# EAGLE design os21_smt (EAGLE 6.5.0)
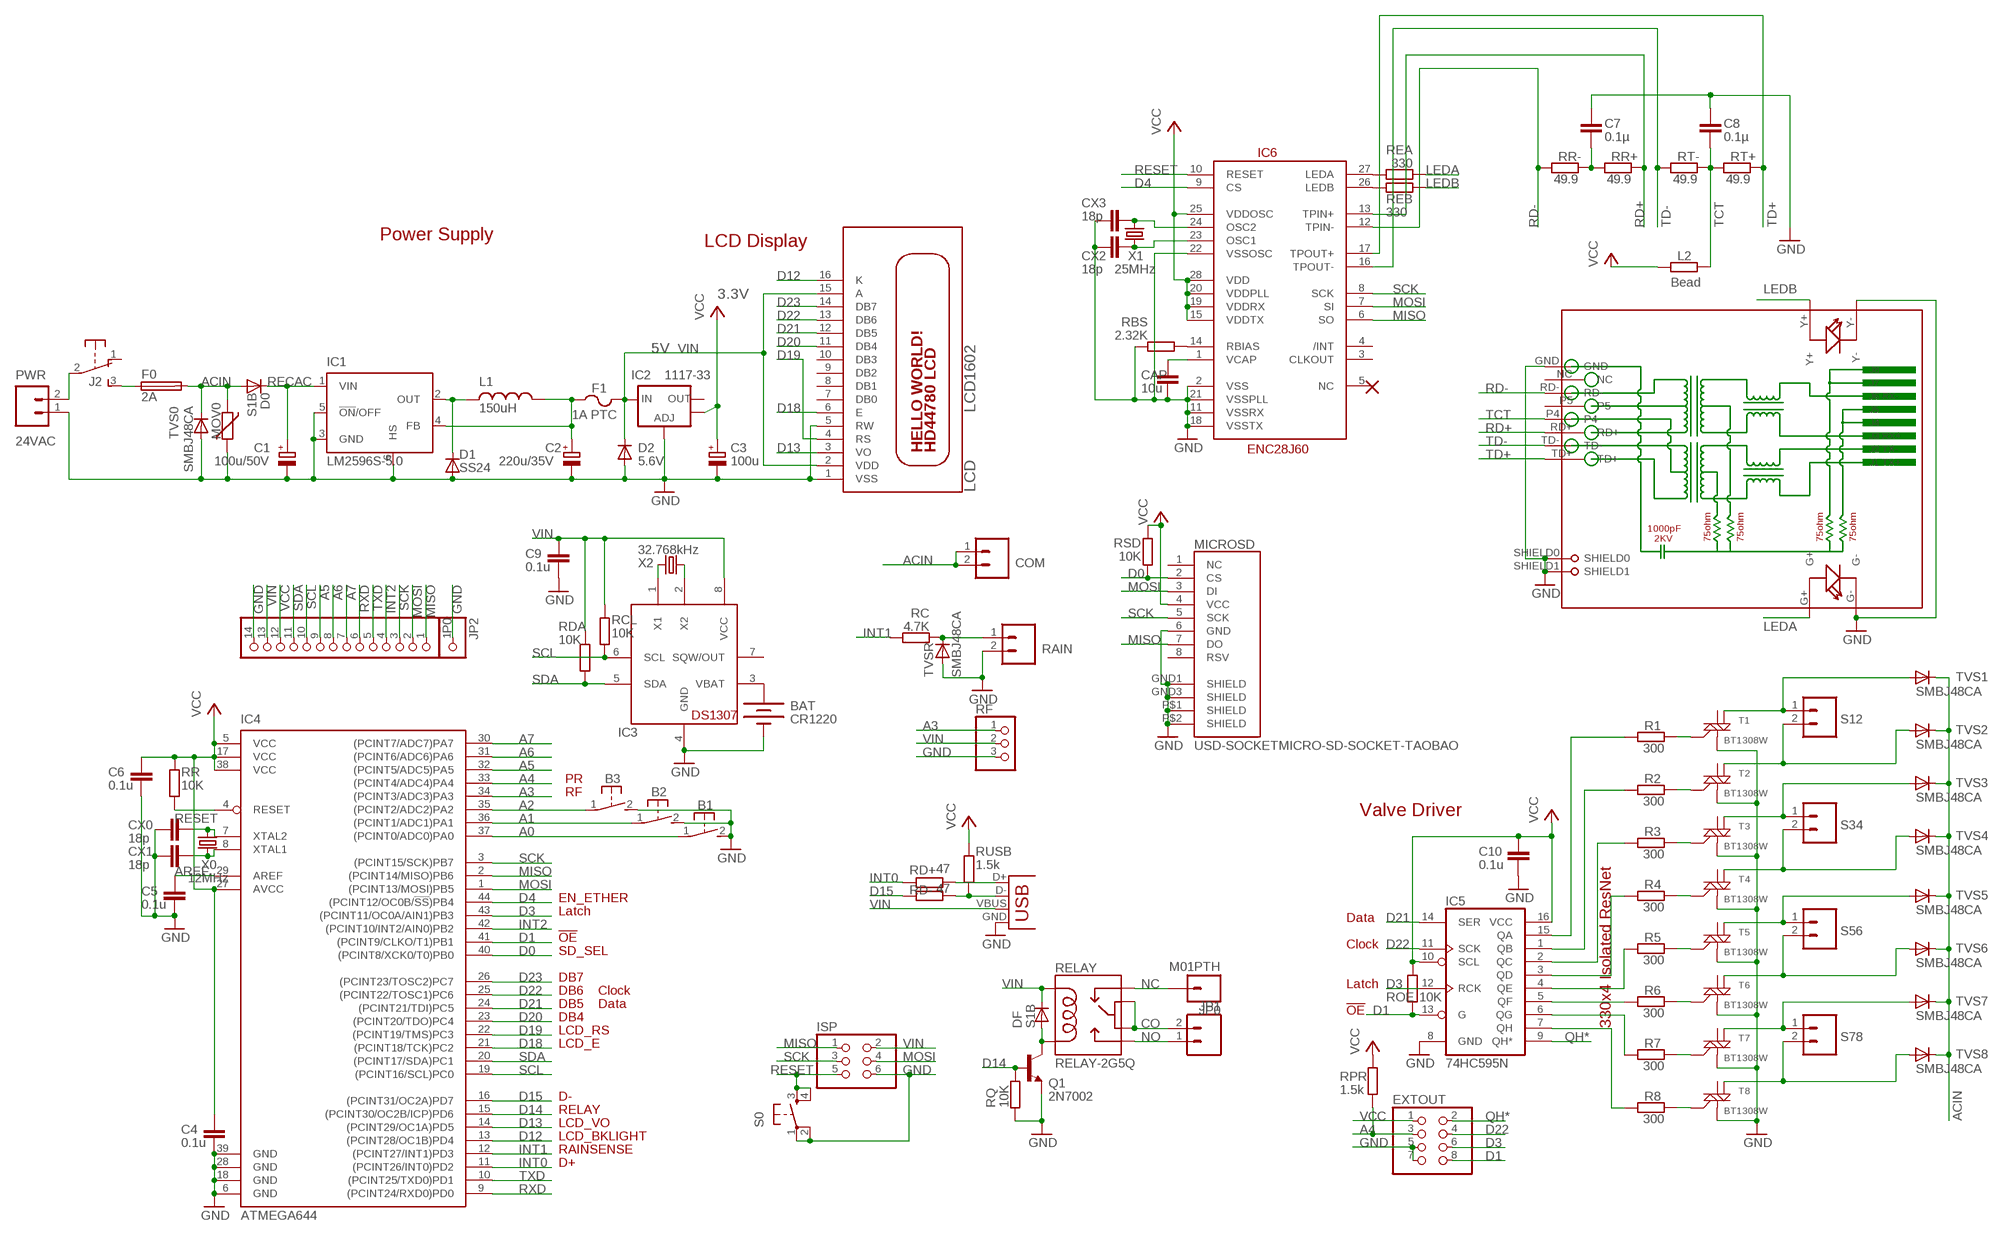
[diagram p0: schematic, sheet 1]

## Parts
B1  31-XX  [B3F-31XX]
B2  31-XX  [B3F-31XX]
B3  31-XX  [B3F-31XX]
BAT  CR1220  BATTERYBATTERY_12MM_SMT  [BATTCON_12MM_SMT]
C1  100u/50V  CPOL-EUE3.5-8  [E3,5-8]
C2  220u/35V  CPOL-EUE3.5-8  [E3,5-8]
C3  100u  CPOL-EUD  [PANASONIC_D]
C4  0.1u  C-EUC0805  [C0805]
C5  0.1u  C-EUC0805  [C0805]
C6  0.1u  C-EUC0805  [C0805]
C7  0.1µ  C-EUC0805  [C0805]
C8  0.1µ  C-EUC0805  [C0805]
C9  0.1u  C-EUC0805  [C0805]
C10  0.1u  C-EUC0805  [C0805]
CAP  10u  C-EUC0805  [C0805]
COM  M025MM-X  [SCREWTERMINAL-5MM-2-X]
CX0  18p  C-EUC0805  [C0805]
CX1  18p  C-EUC0805  [C0805]
CX2  18p  C-EUC0805  [C0805]
CX3  18p  C-EUC0805  [C0805]
D0  S1B  DIODE-DO-214AC  [DO-214AC]
D1  SS24  DIODE-SMB  [SMB]
D2  5.6V  DIODE-MINIMELF  [MINIMELF]
DF  S1B  DIODE-DO-214AC  [DO-214AC]
EXTOUT  PINHD-2X4  [2X04]
F0  2A  FUSESHK20L  [SHK20L]
F1  1A PTC  PTCFUSE-1812  [1812]
IC1  LM2596S-5.0  LM2596S  [TO263-5]
IC2  1117-33  V_REG_LM1117SOT223  [SOT223]
IC3  DS1307  DS1307SOIC  [SO08]
IC4  ATMEGA644  ATMEGA644A  [TQFP44]
IC5  74HC595N  74LS595D  [SO16]
IC6  ENC28J60  ENC28J60SO28LONG  [SOIC28WLONG]
ISP  PINHD-2X3  [2X03]
J2  EG1206  [EG1206]
JP0  M01PTH  [1X01]
JP1  M025MM-X  [SCREWTERMINAL-5MM-2-X]
JP2  PINHD-1X1CB  [1X01-CLEANBIG]
L1  150uH  INDUCTORPWR  [CDRH125]
L2  Bead  R-EU_R0805  [R0805]
LCD  LCD1602  HD44780LCDNOHOLE  [LCD1602A]
MICROSD  USD-SOCKETMICRO-SD-SOCKET-TAOBAO  [MICRO-SD-SOCKET-TAOBAO]
MOV0  MOV  VARISTOR-5  [R-5]
P0  PINHD-1X14-CB  [1X14-CB]
PWR  24VAC  M024MM-X  [SCREWTERMINAL-4MM-2-X]
Q1  2N7002  TRANSISTOR_NPNSOT23-3  [SOT23-3]
R1  300  R-EU_R0805  [R0805]
R2  300  R-EU_R0805  [R0805]
R3  300  R-EU_R0805  [R0805]
R4  300  R-EU_R0805  [R0805]
R5  300  R-EU_R0805  [R0805]
R6  300  R-EU_R0805  [R0805]
R7  300  R-EU_R0805  [R0805]
R8  300  R-EU_R0805  [R0805]
RAIN  M025MM-X  [SCREWTERMINAL-5MM-2-X]
RBS  2.32K  R-EU_R0805  [R0805]
RC  4.7K  R-EU_R0805  [R0805]
RCL  10K  R-EU_R0805  [R0805]
RD+  47  R-EU_R0805  [R0805]
RD-  47  R-EU_R0805  [R0805]
RDA  10K  R-EU_R0805  [R0805]
REA  330  R-EU_R0805  [R0805]
REB  330  R-EU_R0805  [R0805]
RELAY  RELAY-2G5Q  [RELAY-G5V]
RF  PINHD-1X3  [1X03]
RJ45  HR911105A  [HR911105A]
ROE  10K  R-EU_R0805  [R0805]
RPR  1.5k  R-EU_R0805  [R0805]
RQ  10K  R-EU_R0805  [R0805]
RR  10K  R-EU_R0805  [R0805]
RR+  49.9  R-EU_R0805  [R0805]
RR-  49.9  R-EU_R0805  [R0805]
RSD  10K  R-EU_R0805  [R0805]
RT+  49.9  R-EU_R0805  [R0805]
RT-  49.9  R-EU_R0805  [R0805]
RUSB  1.5k  R-EU_R0805  [R0805]
S0  TAC_SWITCHSMD  [TACTILE_SWITCH_SMD]
S12  M025MM-X  [SCREWTERMINAL-5MM-2-X]
S34  M025MM-X  [SCREWTERMINAL-5MM-2-X]
S56  M025MM-X  [SCREWTERMINAL-5MM-2-X]
S78  M025MM-X  [SCREWTERMINAL-5MM-2-X]
T1  BT1308W  MAC97SOT223  [SOT223]
T2  BT1308W  MAC97SOT223  [SOT223]
T3  BT1308W  MAC97SOT223  [SOT223]
T4  BT1308W  MAC97SOT223  [SOT223]
T5  BT1308W  MAC97SOT223  [SOT223]
T6  BT1308W  MAC97SOT223  [SOT223]
T7  BT1308W  MAC97SOT223  [SOT223]
T8  BT1308W  MAC97SOT223  [SOT223]
TVS0  SMBJ48CA  DIODE-SMB  [SMB]
TVS1  SMBJ48CA  DIODE-SMB  [SMB]
TVS2  SMBJ48CA  DIODE-SMB  [SMB]
TVS3  SMBJ48CA  DIODE-SMB  [SMB]
TVS4  SMBJ48CA  DIODE-SMB  [SMB]
TVS5  SMBJ48CA  DIODE-SMB  [SMB]
TVS6  SMBJ48CA  DIODE-SMB  [SMB]
TVS7  SMBJ48CA  DIODE-SMB  [SMB]
TVS8  SMBJ48CA  DIODE-SMB  [SMB]
TVSR  SMBJ48CA  DIODE-SMB  [SMB]
USB  USBPTH  [USB-B-PTH]
X0  12MHz  CRYSTALHC49UV  [HC49U-V]
X1  25MHz  CRYSTALHC49UV  [HC49U-V]
X2  32.768kHz  CRYSTALTC38H  [TC38H]

## Nets
A0: B1.1(P) IC4.37((PCINT0/ADC0)PA0)
A1: B2.1(P) IC4.36((PCINT1/ADC1)PA1)
A2: B3.1(P) IC4.35((PCINT2/ADC2)PA2)
A3: IC4.34((PCINT3/ADC3)PA3) RF.1
A4: EXTOUT.3 IC4.33((PCINT4/ADC4)PA4) RPR.1
A5: IC4.32((PCINT5/ADC5)PA5) P0.9
A6: IC4.31((PCINT6/ADC6)PA6) P0.8
A7: IC4.30((PCINT7/ADC7)PA7) P0.7
ACIN [power]: COM.1 COM.2 D0.A F0.2A MOV0.1 TVS0.C TVS1.C TVS2.C TVS3.C TVS4.C TVS5.C TVS6.C TVS7.C TVS8.C
AREF: C5.1 IC4.29(AREF)
CO [power]: JP1.2 RELAY.5 RELAY.6
D0: IC4.40((PCINT8/XCK0/T0)PB0) MICROSD.2(CS) RSD.1
D1: EXTOUT.8 IC4.41((PCINT9/CLKO/T1)PB1) IC5.13(G) ROE.1
D3: EXTOUT.6 IC4.43((PCINT11/OC0A/AIN1)PB3) IC5.12(RCK)
D4: IC4.44((PCINT12/OC0B/!SS!)PB4) IC6.9(CS)
D12: IC4.13((PCINT28/OC1B)PD4) LCD.16(K)
D13: IC4.14((PCINT29/OC1A)PD5) LCD.3(VO)
D14: IC4.15((PCINT30/OC2B/ICP)PD6) Q1.1(B) RQ.1
D15: IC4.16((PCINT31/OC2A)PD7) RD-.1
D18: IC4.21((PCINT18/TCK)PC2) LCD.6(E)
D19: IC4.22((PCINT19/TMS)PC3) LCD.4(RS)
D20: IC4.23((PCINT20/TDO)PC4) LCD.11(DB4)
D21: IC4.24((PCINT21/TDI)PC5) IC5.14(SER) LCD.12(DB5)
D22: EXTOUT.4 IC4.25((PCINT22/TOSC1)PC6) IC5.11(SCK) LCD.13(DB6)
D23: IC4.26((PCINT23/TOSC2)PC7) LCD.14(DB7)
GND: B1.2(S) B2.2(S) B3.2(S) BAT.P$1(-) C1.- C2.- C3.- C4.2 C5.2 C6.2 C7.1 C8.1 C9.2 C10.2 CAP.2 CX0.2 CX1.2 CX2.2 CX3.2 D1.A D2.A EXTOUT.5 EXTOUT.7 IC1.3(GND) IC1.5(!ON!/OFF) IC1.6(HS) IC2.1(ADJ) IC3.4(GND) IC4.6(GND) IC4.18(GND) IC4.28(GND) IC4.39(GND) IC5.8(GND) IC6.2(VSS) IC6.11(VSSRX) IC6.18(VSSTX) IC6.21(VSSPLL) IC6.22(VSSOSC) ISP.6 JP2.1 LCD.1(VSS) LCD.5(RW) MICROSD.6(GND) MICROSD.GND1(SHIELD) MICROSD.GND3(SHIELD) MICROSD.P$1(SHIELD) MICROSD.P$2(SHIELD) MOV0.2 P0.14 PWR.1 Q1.2(E) RAIN.2 RBS.1 RF.3 RJ45.G- RJ45.GND RJ45.SHIELD0 RJ45.SHIELD1 RJ45.Y- RQ.2 S0.1 S0.2 T1.1(M1) T2.1(M1) T3.1(M1) T4.1(M1) T5.1(M1) T6.1(M1) T7.1(M1) T8.1(M1) TVS0.A TVSR.A USB.GND
INT0: IC4.11((PCINT26/INT0)PD2) RD+.1
INT1: IC4.12((PCINT27/INT1)PD3) RC.1
INT2: IC4.42((PCINT10/INT2/AIN0)PB2) P0.4
LEDA: REA.2 RJ45.G+
LEDB: REB.2 RJ45.Y+
MISO: IC4.2((PCINT14/MISO)PB6) IC6.6(SO) ISP.1 MICROSD.7(DO) P0.1
MOSI: IC4.1((PCINT13/MOSI)PB5) IC6.7(SI) ISP.4 MICROSD.3(DI) P0.2
N$1 [power]: F0.1A J2.3(S)
N$2 [power]: C2.+ F1.1 IC1.4(FB) L1.2
N$3: RAIN.1 RC.2 TVSR.C
N$4: IC5.5(QF) R6.2
N$5: IC5.6(QG) R7.2
N$6 [power]: J2.2(P) PWR.2
N$7: IC5.7(QH) R8.2
N$8: IC3.1(X1) X2.2
N$9 [power]: D1.C IC1.2(OUT) L1.1
N$10: IC5.4(QE) R5.2
N$11: IC5.3(QD) R4.2
N$12: IC5.2(QC) R3.2
N$13: IC5.1(QB) R2.2
N$14: IC5.15(QA) R1.2
N$15: CX0.1 IC4.7(XTAL2) X0.2
N$16 [power]: S12.1 T1.4(M2-4) TVS1.A
N$17 [power]: S12.2 T2.4(M2-4) TVS2.A
N$18 [power]: S34.1 T3.4(M2-4) TVS3.A
N$19: CX1.1 IC4.8(XTAL1) X0.1
N$20 [power]: S34.2 T4.4(M2-4) TVS4.A
N$21: R1.1 T1.3(G)
N$22 [power]: S56.1 T5.4(M2-4) TVS5.A
N$23 [power]: S56.2 T6.4(M2-4) TVS6.A
N$24 [power]: S78.1 T7.4(M2-4) TVS7.A
N$25 [power]: S78.2 T8.4(M2-4) TVS8.A
N$26: R2.1 T2.3(G)
N$27: R3.1 T3.3(G)
N$28: R4.1 T4.3(G)
N$29: R5.1 T5.3(G)
N$30: IC3.2(X2) X2.1
N$31: R6.1 T6.3(G)
N$32: DF.A Q1.3(C) RELAY.9
N$33: R7.1 T7.3(G)
N$34: IC6.27(LEDA) REA.1
N$35: R8.1 T8.3(G)
N$36: BAT.P$2(+) IC3.3(VBAT)
N$37: IC6.26(LEDB) REB.1
N$38: RD+.2 USB.D+
N$39: CAP.1 IC6.1(VCAP)
N$41: CX3.1 IC6.24(OSC2) X1.2
N$42: CX2.1 IC6.23(OSC1) X1.1
N$45: RD-.2 RUSB.1 USB.D-
N$54: C7.2 RR+.2 RR-.1
N$59: IC6.14(RBIAS) RBS.2
NC [power]: JP0.1 RELAY.1
NO [power]: JP1.1 RELAY.10
QH*: EXTOUT.2 IC5.9(QH*)
RD+: IC6.13(TPIN+) RJ45.RD+ RR+.1
RD-: IC6.12(TPIN-) RJ45.RD- RR-.2
RECAC [power]: C1.+ D0.C IC1.1(VIN)
RESET: IC4.4(RESET) IC6.10(RESET) ISP.5 RR.1 S0.3 S0.4
RXD: IC4.9((PCINT24/RXD0)PD0) P0.6
SCK: IC4.3((PCINT15/SCK)PB7) IC6.8(SCK) ISP.3 MICROSD.5(SCK) P0.3
SCL: IC3.6(SCL) IC4.19((PCINT16/SCL)PC0) P0.10 RCL.1
SDA: IC3.5(SDA) IC4.20((PCINT17/SDA)PC1) P0.11 RDA.1
TCT: C8.2 L2.1 RJ45.P4 RT+.2 RT-.1
TD+: IC6.17(TPOUT+) RJ45.TD+ RT+.1
TD-: IC6.16(TPOUT-) RJ45.TD- RT-.2
TXD: IC4.10((PCINT25/TXD0)PD1) P0.5
VCC: C3.+ C4.1 C6.1 C10.1 EXTOUT.1 IC2.4(OUT) IC4.5(VCC) IC4.17(VCC) IC4.27(AVCC) IC4.38(VCC) IC5.10(SCL) IC5.16(VCC) IC6.15(VDDTX) IC6.19(VDDRX) IC6.20(VDDPLL) IC6.25(VDDOSC) IC6.28(VDD) L2.2 MICROSD.4(VCC) P0.12 ROE.2 RPR.2 RR.2 RSD.2 RUSB.2
VIN [power]: C9.1 D2.C DF.C F1.2 IC2.3(IN) IC3.8(VCC) ISP.2 LCD.2(VDD) LCD.15(A) P0.13 RCL.2 RDA.2 RELAY.2 RF.2 USB.VBUS
Unconnected: IC2.2(OUT) IC3.7(SQW/OUT) IC6.3(CLKOUT) IC6.4(/INT) IC6.5(NC) J2.1(O) LCD.7(DB0) LCD.8(DB1) LCD.9(DB2) LCD.10(DB3) MICROSD.1(NC) MICROSD.8(RSV) RJ45.NC RJ45.P5 T1.2(M2) T2.2(M2) T3.2(M2) T4.2(M2) T5.2(M2) T6.2(M2) T7.2(M2) T8.2(M2)

## Notes on the sheet
- Power Supply
- LCD Display
- 3.3V
- 5V
- PR
- RF
- Valve Driver
- EN_ETHER
- Latch
- Data
- !OE
- Clock
- SD_SEL
- DB7
- Latch
- DB6 | Clock
- DB5 | Data
- !OE
- DB4
- 330x4 Isolated ResNet
- LCD_RS
- LCD_E
- D-
- RELAY
- LCD_VO
- LCD_BKLIGHT
- RAINSENSE
- D+

## Library data of the parts
B1-B3 = adafruit:31-XX: OMRON SWITCH Now with beefier pads!
BAT = SparkFunNew:BATTERY: Battery Holders Various common sizes : AA, AAA, 20mm coin cell and 12mm coin cell.
C1-C3 = resistor:CPOL-EU: POLARIZED CAPACITOR, European symbol
C4-C6 C9 C10 = rcl:C-EU: CAPACITOR, European symbol
C7 C8 CAP CX0 CX1-CX3 = resistor:C-EU: CAPACITOR, European symbol
COM JP1 PWR RAIN S12 S34 S56 S78 = SparkFun:M02: Header 2 Standard 2-pin 0.1" header. Use with straight break away headers (SKU : PRT-00116), right angle break away headers (PRT-00553), swiss pins (PRT-00743), machine pins (PRT-00117), and female headers (PRT-00115). Molex polarized connector foot print use with SKU : PRT-08233 with associated crimp pins and housings.
D0 D1 D2 DF TVS0 TVS1-TVS8 TVSR = diode:DIODE-: DIODE
EXTOUT = pinhead:PINHD-2X4: PIN HEADER
F0 = fuse:FUSE: Fuse; OC_FARNELL: unknown; OC_NEWARK: unknown
F1 = adafruit:PTCFUSE: PTC fuses, resettable thermistors
IC1 = national-semiconductor:LM2596: SIMPLE SWITCHER® Power Converter 150 kHz 3A Step-Down Voltage Regulator Source: http://www.national.com/ds/LM/LM2596.pdf; MF: NATIONAL SEMICONDUCTOR; MPN: LM2596S-ADJ/NOPB; OC_FARNELL: 9494367; OC_NEWARK: 41K3842
IC2 = SparkFun:V_REG_LM1117: Voltage Regulator LM1117 Standard adjustable voltage regulator but in SMD form. Spark Fun Electronics SKU : COM-00595
IC3 = adafruit:DS1307: DS1307 Real time clock (RTC) with battery backup ability. Talk to it via i2c
IC4 = atmel:ATMEGA644: 8-bit Microcontroller with 64K Bytes In-System Programmable Flash Source: http://www.atmel.com/dyn/resources/prod_documents/doc2593.pdf; MPN: ATMEGA644PV-10AU; OC_FARNELL: 1455123; OC_NEWARK: 58M3748
IC5 = SparkFun:74*595: 8-bit SHIFT REGISTER, output latch
IC6 = SparkFun:ENC28J60
ISP = pinhead:PINHD-2X3: PIN HEADER
J2 = adafruit:EG1206
JP0 = SparkFun:M01: Header 1 Standard 1-pin 0.1" header. Use with straight break away headers (SKU : PRT-00116), right angle break away headers (PRT-00553), swiss pins (PRT-00743), machine pins (PRT-00117), and female headers (PRT-00115).
JP2 = adafruit:PINHD-1X1: Pin header 1x1 for 0.1" spacing With round pins
L1 = SparkFunNew:INDUCTOR: Inductors Basic Inductor/Choke - 0603 and 1206. Footprints are not proven and vary greatly between part numbers.
L2 R1-R8 RBS RC RCL RD+ RD- RDA REA REB ROE RPR RQ RR RR+ RR- RSD RT+ RT- RUSB = rcl:R-EU_: RESISTOR, European symbol
LCD = adafruit:HD44780LCD: HD44780 LCD Standard character type LCDs, available in sizes from 8x1 to 40x4!
MICROSD = SparkFunNew:USD-SOCKET: microSD Socket Push-push type uSD socket. Schematic element and footprint production proven. Spark Fun Electronics SKU : PRT-00127. tDoc lines correctly indicate media card edge positions when inserting (unlocked, locked, depressed).
MOV0 = varistor:VARISTOR: VARISTOR
P0 = adafruit:PINHD-1X14: PIN HEADER
Q1 = SparkFunNew:TRANSISTOR_NPN: Transistor NPN BJT configuration in SOT23 package. MMBT2222 is the common NPN we use. Double check BCE configuration again layout.
RELAY = SparkFunNew:RELAY-2
RF = pinhead:PINHD-1X3: PIN HEADER
RJ45 = CONNECTER:HR911105A
S0 = SparkFunNew:TAC_SWITCH: Momentary Switch Button commonly used for reset or general input. Spark Fun Electronics SKU : COM-00097
T1-T8 = SparkFun:MAC97: MAC97 Triac http://www.onsemi.com/pub_link/Collateral/MAC97-D.PDF
USB = SparkFunNew:USB: USB Connectors USB-B-PTH is fully proven SKU : PRT-00139 USB-miniB is fully proven SKU : PRT-00587 USB-A-PCB is untested. USB-A-H is throughly reviewed, but untested. Spark Fun Electronics SKU : PRT-00437 USB-B-SMT is throughly reviewed, but untested. Needs silkscreen touching up. USB-A-S has not been used/tested USB-MB-H has not been used/tested
X0 X1 = SparkFun:CRYSTAL: Crystals Various standard crystals. Proven footprints. Spark Fun Electronics SKU : COM-00534
X2 = crystal:CRYSTAL: CRYSTAL; OC_FARNELL: unknown; OC_NEWARK: unknown

## Net classes
0 default: width 0.203 mm, clearance 0.203 mm
1 power: width 0.406 mm, clearance 0.203 mm

## Board
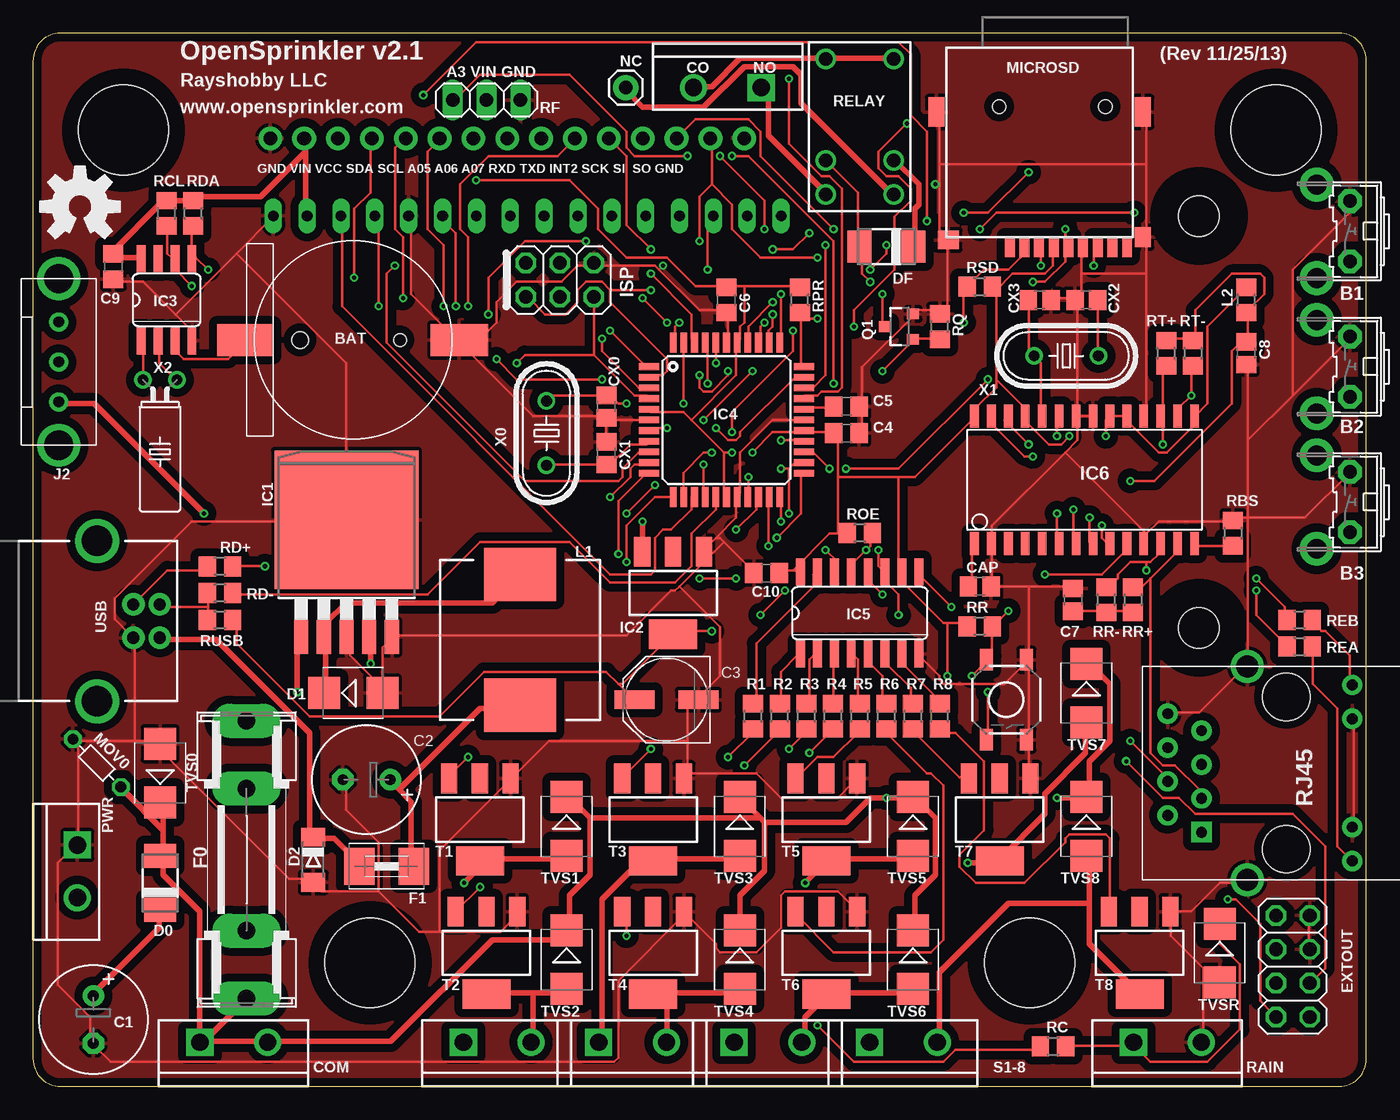
[diagram p1: board, top side]
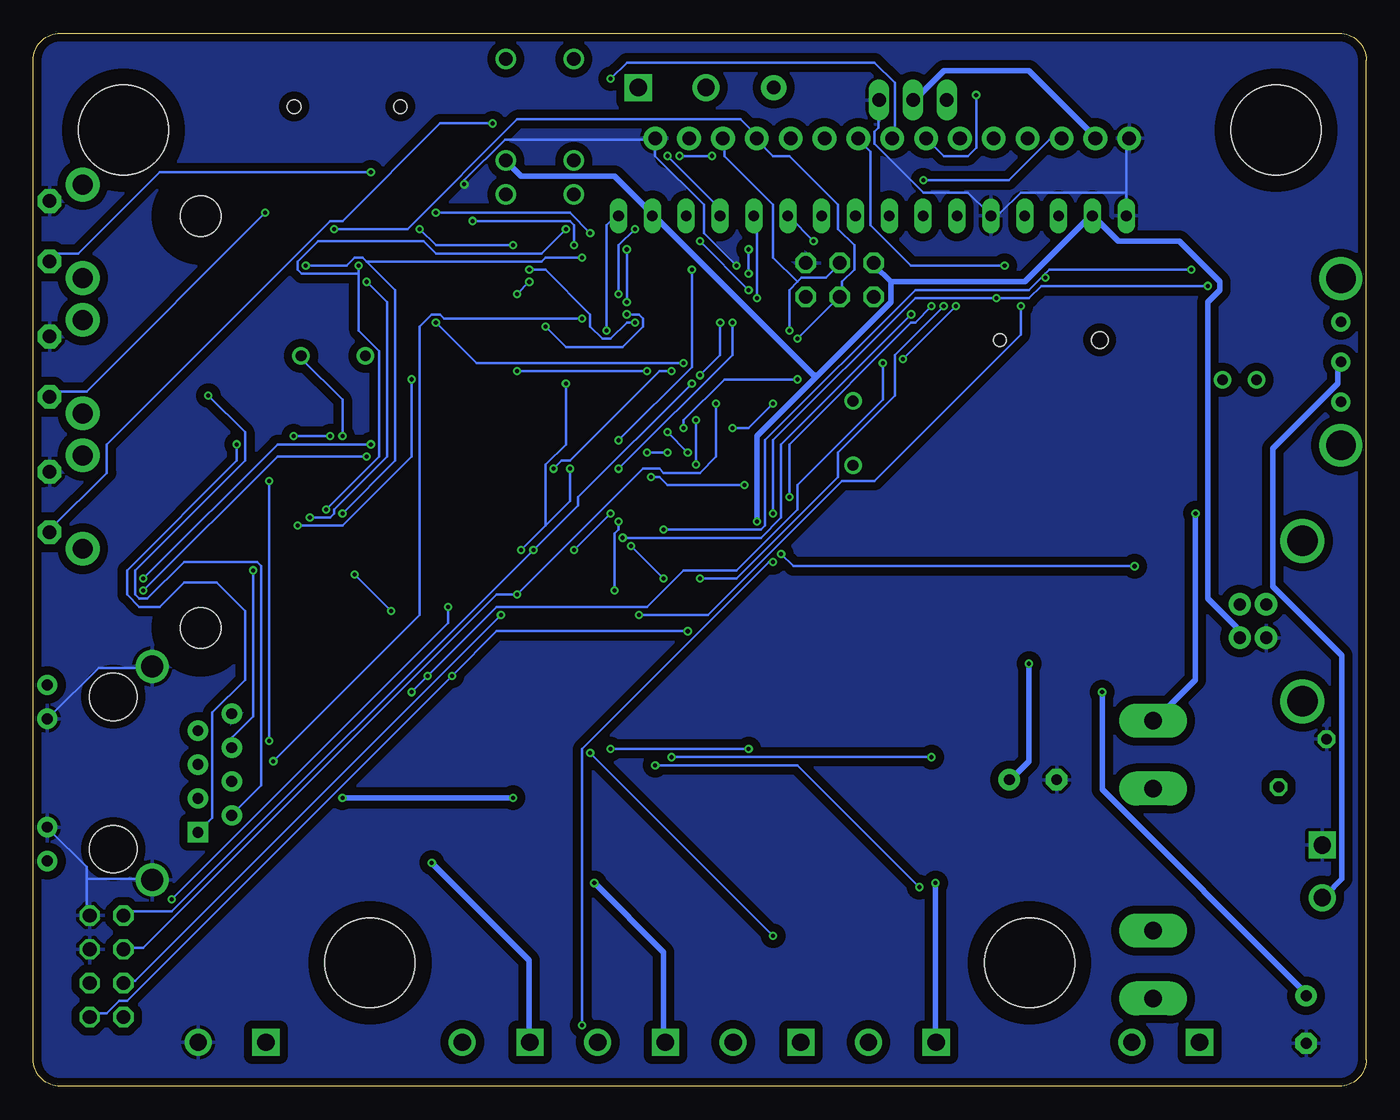
[diagram p2: board, bottom side, seen from below]

Size 100 x 79 mm. Coordinates in mm from the lower left corner, seen from the top.
Outline: 98,79 2,79 arc90 0,77 0,2 arc90 2,0 98,0 arc90 100,2 100,77 arc90 98,79
Copper layers (1*16): Top 0.035mm / dielectric 1.5mm / Bottom 0.035mm
Design rules "Fusion_eagle_rule_v1.1": minimum track width 6mil, minimum drill 12mil, track to track 6mil, track to pad 6mil, pad to pad 6mil, via to via 6mil, smd to smd 0mil, copper to edge 10mil, drill to drill 10mil, minimum pad ring 10mil, minimum via ring 6mil, stop-mask expansion 2mil, vias tented up to drill 100mil, thermal gap 10mil
Holes 3.05 mm at 87.46,65.3 87.46,34.38
Holes 6.75 mm at 6.76,71.74 93.24,71.74 25.26,9.26 74.74,9.26
tRestrict: area 84.4,31.3 to 90.5,37.4; area 84.4,62.2 to 90.5,68.3; area 2.8,67.7 to 10.8,75.7; area 89.2,67.7 to 97.2,75.7; area 21.3,5.3 to 29.3,13.3; area 70.7,5.3 to 78.7,13.3
bRestrict: area 2.8,67.7 to 10.8,75.7; area 89.2,67.7 to 97.2,75.7; area 21.3,5.3 to 29.3,13.3; area 70.7,5.3 to 78.7,13.3; area 84.4,62.2 to 90.5,68.3; area 84.4,31.3 to 90.5,37.4
vRestrict: area 16.5,68.4 to 54,69.3

### Footprints (pad centres in the part's own frame; a part is rotated, then mirrored left to right if it is on the bottom)
B3F-31XX = drill 1.016 pad 1.778 octagon: 1 -2.261,-1.245; 2 2.261,-1.245 | drill 1.499 pad 2.54: 3 -3.505,1.245; 4 3.505,1.245
BATTCON_12MM_SMT = smd 2.4 x 4.3: P$1 0,11.96 | smd 2.4 x 4.2: P$2 0,-4.1 | hole 0.95: 0,7.5 | hole 1.25: 0,0
E3,5-8 = drill 0.813 pad 1.6: + -1.778,0 | drill 0.813 pad 1.6 octagon: - 1.778,0
PANASONIC_D = smd 3 x 1.4: + 2.4,0; - -2.4,0
C0805 = smd 1.3 x 1.5: 1 -0.95,0; 2 0.95,0
C0805' = smd 1.3 x 1.5: 1 -0.85,0; 2 0.85,0
SCREWTERMINAL-5MM-2-X = drill 1.3 pad 2.032 square: 1 0,0 | drill 1.3 pad 2.032: 2 5.08,0
DO-214AC = smd 1.8 x 2.4: A 2.025,0; C -2.025,0
SMB = smd 2.4 x 2.4: A 2.2,0; C -2.2,0
MINIMELF = smd 1.4 x 1.8: A 1.7,0; C -1.7,0
2X04 = drill 1.016 octagon: 1 -3.81,-1.27; 2 -3.81,1.27; 3 -1.27,-1.27; 4 -1.27,1.27; 5 1.27,-1.27; 6 1.27,1.27; 7 3.81,-1.27; 8 3.81,1.27
SHK20L = drill 1.321 pad 2.54 long: 1A -10.414,0; 1B -5.334,0; 2A 10.414,0; 2B 5.334,0
1812 = smd 2.286 x 2.794: 1 -2.046,0; 2 2.046,0
TO263-5 = smd 1.067 x 2.54: 1 -3.404,-5.791; 2 -1.702,-5.791; 3 0,-5.791; 4 1.702,-5.791; 5 3.404,-5.791 | smd 10.8 x 10.41: 6 0,3
SOT223 = smd 1.219 x 2.235: 1 -2.311,-3.099; 2 0,-3.099; 3 2.311,-3.099 | smd 3.6 x 2.2: 4 0,3.099
SO08 = smd 0.66 x 2.032: 1 -1.905,-3.073; 2 -0.635,-3.073; 3 0.635,-3.073; 4 1.905,-3.073; 5 1.905,3.073; 6 0.635,3.073; 7 -0.635,3.073; 8 -1.905,3.073
TQFP44 = smd 1.5 x 0.5: 1 -5.8,4; 2 -5.8,3.2; 3 -5.8,2.4; 4 -5.8,1.6; 5 -5.8,0.8; 6 -5.8,0; 7 -5.8,-0.8; 8 -5.8,-1.6; 9 -5.8,-2.4; 10 -5.8,-3.2; 11 -5.8,-4; 23 5.8,-4; 24 5.8,-3.2; 25 5.8,-2.4; 26 5.8,-1.6; 27 5.8,-0.8; 28 5.8,0; 29 5.8,0.8; 30 5.8,1.6; 31 5.8,2.4; 32 5.8,3.2; 33 5.8,4 | smd 0.5 x 1.5: 12 -4,-5.8; 13 -3.2,-5.8; 14 -2.4,-5.8; 15 -1.6,-5.8; 16 -0.8,-5.8; 17 0,-5.8; 18 0.8,-5.8; 19 1.6,-5.8; 20 2.4,-5.8; 21 3.2,-5.8; 22 4,-5.8; 34 4,5.8; 35 3.2,5.8; 36 2.4,5.8; 37 1.6,5.8; 38 0.8,5.8; 39 0,5.8; 40 -0.8,5.8; 41 -1.6,5.8; 42 -2.4,5.8; 43 -3.2,5.8; 44 -4,5.8
SO16 = smd 0.66 x 2.032: 1 -4.445,-3.073; 2 -3.175,-3.073; 3 -1.905,-3.073; 4 -0.635,-3.073; 5 0.635,-3.073; 6 1.905,-3.073; 7 3.175,-3.073; 8 4.445,-3.073; 9 4.445,3.073; 10 3.175,3.073; 11 1.905,3.073; 12 0.635,3.073; 13 -0.635,3.073; 14 -1.905,3.073; 15 -3.175,3.073; 16 -4.445,3.073
SOIC28WLONG = smd 0.65 x 1.7: 1 -8.89,-4.78; 2 -7.62,-4.78; 3 -6.35,-4.78; 4 -5.08,-4.78; 5 -3.81,-4.78; 6 -2.54,-4.78; 7 -1.27,-4.78; 8 0,-4.78; 9 1.27,-4.78; 10 2.54,-4.78; 11 3.81,-4.78; 12 5.08,-4.78; 13 6.35,-4.78; 14 7.62,-4.78; 15 7.62,4.78; 16 6.35,4.78; 17 5.08,4.78; 18 3.81,4.78; 19 2.54,4.78; 20 1.27,4.78; 21 0,4.78; 22 -1.27,4.78; 23 -2.54,4.78; 24 -3.81,4.78; 25 -5.08,4.78; 26 -6.35,4.78; 27 -7.62,4.78; 28 -8.89,4.78
2X03 = drill 1.016 octagon: 1 -2.54,-1.27; 2 -2.54,1.27; 3 0,-1.27; 4 0,1.27; 5 2.54,-1.27; 6 2.54,1.27
EG1206 = drill 0.8 pad 1.422: 1 -3,0; 2 0,0; 3 3,0 | drill 2.2: MT1 -6.25,0; MT2 6.25,0
1X01 = drill 1.016 pad 1.88: 1 0,0
1X01-CLEANBIG = drill 1.016 pad 1.778: 1 0,0
CDRH125 = smd 5.4 x 4: 1 0,4.9; 2 0,-4.9
R0805 = smd 1.3 x 1.5: 1 -0.95,0; 2 0.95,0
LCD1602A = drill 0.8 long: 1 8,33.46; 2 10.54,33.46; 3 13.08,33.46; 4 15.62,33.46; 5 18.16,33.46; 6 20.7,33.46; 7 23.24,33.46; 8 25.78,33.46; 9 28.32,33.46; 10 30.86,33.46; 11 33.4,33.46; 12 35.94,33.46; 13 38.48,33.46; 14 41.02,33.46; 15 43.56,33.46; 16 46.1,33.46
MICRO-SD-SOCKET-TAOBAO = smd 0.75 x 1.6: 1 2.25,10.5; 2 1.15,10.5; 3 0.05,10.5; 4 -1.05,10.5; 5 -2.15,10.5; 6 -3.25,10.5; 7 -4.35,10.5; 8 -5.45,10.5 | smd 0.7 x 1.6: CD -6.55,10.5 | smd 1.2 x 1.5: GND1 -7.75,9.8 | smd 1.6 x 1.4: GND3 6.85,10 | smd 1.2 x 2.2: P$1 7.75,0.4; P$2 -7.75,0.4 | hole 1: 3.05,0; -4.93,0
R-5 = drill 0.813 octagon: 1 -2.54,0; 2 2.54,0
1X14-CB = drill 1.016 pad 1.778: 1 -16.51,0; 2 -13.97,0; 3 -11.43,0; 4 -8.89,0; 5 -6.35,0; 6 -3.81,0; 7 -1.27,0; 8 1.27,0; 9 3.81,0; 10 6.35,0; 11 8.89,0; 12 11.43,0; 13 13.97,0; 14 16.51,0
SCREWTERMINAL-4MM-2-X = drill 1.3 pad 2.032 square: 1 0,0 | drill 1.3 pad 2.032: 2 3.96,0
SOT23-3 = smd 0.8 x 0.9: 1 -0.95,-1; 2 0.95,-1; 3 0,1.1
RELAY-G5V = drill 1.016: 1 5.08,2.54; 2 2.54,2.54; 5 -5.08,2.54; 6 -5.08,-2.54; 9 2.54,-2.54; 10 5.08,-2.54
1X03 = drill 1.016 long: 1 -2.54,0; 2 0,0; 3 2.54,0
HR911105A = drill 0.813 pad 1.524: G+ 4.953,-6.604; G- 4.953,-4.064; GND -8.89,4.445; NC -6.35,3.175; P4 -8.89,-0.635; P5 -6.35,0.635; RD+ -6.35,-1.905; RD- -8.89,1.905; TD- -8.89,-3.175; Y+ 4.953,6.604; Y- 4.953,4.064 | drill 1.651 pad 2.159: SHIELD0 -2.921,8.001; SHIELD1 -2.921,-8.001 | drill 0.813 pad 1.524 square: TD+ -6.35,-4.445 | hole 3.556: 0,-5.715; 0,5.715
TACTILE_SWITCH_SMD = smd 1.6 x 1: 1 -3,1.5; 2 3,1.5; 3 -3,-1.5; 4 3,-1.5
USB-B-PTH = drill 0.914 pad 1.676: D+ 0,1.25; D- 1.981,1.25; GND 0,-1.25; VBUS 1.981,-1.25 | drill 2.286: S1 -2.718,-6.02; S2 -2.718,6.02
HC49U-V = drill 0.813: 1 -2.413,0; 2 2.413,0
TC38H = drill 0.813: 1 -1.27,0; 2 1.27,0

### Placement (x,y rotation side)
B1  97.54,64.15 90 top
B2  97.54,53.99 90 top
B3  97.54,43.83 90 top
BAT  20,56 270 top
C1  4.5,5 270 top
C2  25,23 180 top
C3  47.5,29 180 top
C4  61,49 0 top
C5  61,51 0 top
C6  52,59 270 top
C7  0.1µ  [C0805']  78,36.5 270 top
C8  0.1µ  [C0805']  91,55 90 top
C9  6,61.5 270 top
C10  55,38.5 180 top
CAP  10u  [C0805']  71,37.5 0 top
COM  12.5,3.3 0 top
CX0  18p  [C0805']  43,51 270 top
CX1  18p  [C0805']  43,47.5 90 top
CX2  18p  [C0805']  79,59 180 top
CX3  18p  [C0805']  75.5,59 0 top
D0  9.52,15.25 90 top
D1  24,29.5 0 top
D2  21,17 270 top
DF  64,63 180 top
EXTOUT  94.5,9 90 top
F0  16,17 270 top
F1  26.5,16.5 180 top
IC1  23.5,39.5 0 top
IC2  48,37 180 top
IC3  10,59 0 top
IC4  52,50 0 top
IC5  62,35.5 0 top
IC6  79.5,45.5 0 top
ISP  39.5,60.5 0 top
J2  1.9,54.34 270 top
JP0  44.45,74.93 0 top
JP1  54.61,74.93 180 top
JP2  53.34,71.12 0 top
L1  36.5,33.5 0 top
L2  91,59 90 top
LCD  10,31.84 0 top
MICROSD  75.5,73.5 180 top
MOV0  4.77,24.25 135 top
P0  34.29,71.12 180 top
PWR  3.3,18.1 270 top
Q1  65,57 90 top
R1  54,27.75 90 top
R2  56,27.75 90 top
R3  58,27.75 90 top
R4  60,27.75 90 top
R5  62,27.75 90 top
R6  64,27.75 90 top
R7  66,27.75 90 top
R8  68,27.75 90 top
RAIN  82.55,3.3 0 top
RBS  90,41.5 270 top
RC  76.5,3 0 top
RCL  10,65.5 90 top
RD+  14,39 180 top
RD-  14,37 180 top
RDA  12,65.5 90 top
REA  95,33 0 top
REB  95,35 0 top
RELAY  62,72 270 top
RF  34,74 0 top
RJ45  94,23.5 0 top
ROE  62,41.5 180 top
RPR  57.5,59 90 top
RQ  68,57 90 top
RR  71,34.5 180 top
RR+  82.5,36.5 270 top
RR-  80.5,36.5 90 top
RSD  71,60 0 top
RT+  85,55 90 top
RT-  87,55 270 top
RUSB  14,35 0 top
S0  73,29 270 top
S12  32.26,3.3 0 top
S34  42.42,3.3 0 top
S56  52.58,3.3 0 top
S78  62.74,3.3 0 top
T1  33.5,20 180 top
T2  34,10 180 top
T3  46.5,20 180 top
T4  46.5,10 180 top
T5  59.5,20 180 top
T6  59.5,10 180 top
T7  72.5,20 180 top
T8  83,10 180 top
TVS0  9.52,23.5 90 top
TVS1  40,19.5 270 top
TVS2  40,9.5 270 top
TVS3  53,19.5 270 top
TVS4  53,9.5 270 top
TVS5  66,19.5 270 top
TVS6  66,9.5 270 top
TVS7  79,29.5 270 top
TVS8  79,19.5 270 top
TVSR  89,10 270 top
USB  7.5,34.9 0 top
X0  38.5,49 90 top
X1  77.5,54.8 180 top
X2  9.5,53 180 top

### Tracks (layer width: path | path; a pad name or v marks a point on that pad's centre or on a via)
A0  (via drill 0.3)
  Top 0.203: v55.47,58.83 53.65,57 53.65,56.08 IC4.37 | v55.47,62.79 57,62.79 v58.22,64.01 | v69.8,65.53 71.63,65.53 v74.68,68.58
  Bottom 0.203: v55.47,62.79 v55.47,58.83 | v58.22,64.01 59.74,65.53 v69.8,65.53 | v74.68,68.58 90.53,68.58 96.62,62.48 98.45,62.48 98.75,62.18 B1.1
A1  (via drill 0.3)
  Top 0.203: v54.86,57.3 54.56,57 54.56,56.08 IC4.36 | v62.79,61.27 64.01,62.48 v64.01,63.09 | v71.02,64.31 72.24,65.53 v82.6,65.53
  Bottom 0.203: v54.86,57.3 55.47,57.3 56.69,56.08 57.3,56.08 58.22,57 58.22,57.91 61.57,61.27 v62.79,61.27 | v64.01,63.09 69.8,63.09 v71.02,64.31 | v82.6,65.53 96.01,52.12 98.45,52.12 98.75,51.82 B2.1
A2  (via drill 0.3)
  Top 0.203: v55.47,57.91 55.47,57 55.17,56.69 55.17,56.08 IC4.35 | v61.57,57 61.57,58.22 64.62,61.27 64.62,65.23 65.84,66.45 65.84,67.36 64.92,68.28 64.01,68.28 63.4,68.89 63.4,70.1 v65.53,72.24
  Bottom 0.203: v55.47,57.91 54.56,57.91 54.25,57.61 54.25,57 55.78,55.47 60.05,55.47 v61.57,57 | v65.53,72.24 69.49,72.24 76.81,64.92 77.72,64.92 94.49,48.16 94.49,46.02 98.75,41.76 B3.1
A3  (via drill 0.3)
  Top 0.203: v56.08,59.44 56.08,56.08 IC4.34 | v54.86,64.31 54.86,66.45 v51.51,69.8 | v49.07,69.8 45.11,69.8 44.5,70.41 44.5,71.63 40.23,75.89 33.53,75.89 31.7,74.07 RF.1
  Bottom 0.203: v56.08,59.44 56.08,63.09 v54.86,64.31 | v49.07,69.8 v51.51,69.8
A4  (via drill 0.3)
  Top 0.203: 57.61,57.61 57.61,57.91 RPR.1 57.61,57.61 | 57.61,57.61 57.61,53.95 IC4.33 | v58.83,57.61 57.61,57.61 | v81.99,24.38 84.73,21.64 85.95,21.64 87.17,20.42 94.49,20.42 96.93,17.98 96.93,8.84 96.01,7.92 EXTOUT.3
  Bottom 0.203: v58.83,57.61 69.19,57.61 69.49,57.91 70.1,57.91 71.02,57 71.02,35.36 v81.99,24.38
A5  (via drill 0.3)
  Top 0.203: v51.21,49.38 52.12,48.46 52.73,48.46 53.03,48.77 53.03,49.07 57,53.03 57.61,53.03 IC4.32 | v42.67,53.03 36.27,53.03 v34.75,54.56 | v30.79,58.52 30.79,63.09 29.57,64.31 29.57,70.1 30.48,71.02 P0.9
  Bottom 0.203: v51.21,49.38 51.21,49.99 48.16,53.03 v42.67,53.03 | v30.79,58.52 v34.75,54.56
A6  (via drill 0.3)
  Top 0.203: v59.44,63.09 59.44,53.34 58.52,52.43 57.91,52.43 IC4.31 | v67.06,64.92 67.06,71.63 65.84,72.85 65.84,77.42 64.92,78.33 33.22,78.33 v29.26,74.37
  Bottom 0.203: v59.44,63.09 59.44,64.62 59.74,64.92 v67.06,64.92 | v29.26,74.37 29.26,70.41 29.87,69.8 31.7,69.8 P0.8
A7  (via drill 0.3)
  Top 0.203: v56.69,75.59 56.69,70.71 59.13,68.28 59.74,68.28 60.66,67.36 60.66,52.43 60.35,52.12 59.13,52.12 58.83,51.82 57.91,51.82 IC4.30
  Bottom 0.203: v56.69,75.59 55.47,76.81 36.88,76.81 35.36,75.29 35.36,71.32 P0.7
ACIN  (via drill 0.3)
  Top 0.406: 9.75,19.2 9.75,21.03 TVS0.C | 9.75,19.2 9.75,17.37 D0.A 9.75,17.07 9.75,15.85 12.5,13.11 12.5,3.35 COM.1 12.8,3.35 | 9.75,19.2 6.71,22.25 MOV0.1 | 12.8,3.35 15.85,6.4 F0.2A | 12.8,3.35 17.37,3.35 COM.2 17.68,3.35 26.82,3.35 34.44,10.97 39.32,10.97 39.93,11.58 TVS2.C 40.23,11.89 40.23,14.33 41.76,15.85 41.76,20.12 | TVS7.C 79.25,31.7 80.77,30.18 80.77,25.91 79.25,24.38 79.25,21.95 TVS8.C 78.94,21.64 v76.81,21.64 | 41.76,20.12 40.23,21.64 TVS1.C | TVS6.C 66.14,11.89 66.14,14.33 67.67,15.85 67.67,20.12 66.14,21.64 TVS5.C 65.84,21.64 v64.01,21.64 62.79,21.64 60.96,19.81 54.86,19.81 | 54.86,19.81 54.86,16.15 53.03,14.33 53.03,11.89 TVS4.C | 54.56,20.12 53.03,21.64 TVS3.C | 54.56,20.12 54.86,19.81 | 54.56,20.12 41.76,20.12
  Bottom 0.406: v64.01,21.64 v76.81,21.64
AREF
  Top 0.203: IC4.29 57.91,50.9 60.05,50.9 C5.1
CO
  Top 0.406: RELAY.5 64.31,77.11 59.74,77.11 RELAY.6 59.44,77.11 53.03,77.11 50.9,74.98 49.68,74.98 JP1.2
D0  (via drill 0.3)
  Top 0.203: v51.21,54.25 51.21,55.78 IC4.40 | v69.8,57.3 69.8,59.74 RSD.1 70.1,60.05 71.32,61.27 73.15,61.27 74.07,62.18 74.07,62.79 MICROSD.2
  Bottom 0.203: v51.21,54.25 66.75,54.25 v69.8,57.3
D1  (via drill 0.3)
  Top 0.203: ROE.1 62.79,41.45 62.79,40.54 v62.48,40.23 61.57,39.32 61.57,38.71 IC5.13 | v50.6,52.73 50.6,55.78 IC4.41
  Bottom 0.203: v50.6,52.73 59.13,44.2 59.13,43.59 v62.48,40.23 89.61,13.11 92.96,13.11 EXTOUT.8
D3  (via drill 0.3)
  Top 0.203: v48.77,51.21 48.77,55.78 IC4.43 | v63.7,36.88 62.79,37.8 62.79,38.41 IC5.12
  Bottom 0.203: v48.77,51.21 48.77,47.24 49.99,46.02 52.73,46.02 53.03,46.33 54.25,46.33 v63.7,36.88 65.23,36.88 91.75,10.36 92.96,10.36 EXTOUT.6
D4  (via drill 0.3)
  Top 0.203: v48.46,57.3 48.16,57 48.16,56.08 IC4.44 | v49.99,53.34 49.99,52.43 50.29,52.12 50.9,52.12 52.12,53.34 v52.12,53.65 | v60.96,46.33 64.92,46.33 v71.63,53.03 | v80.16,42.06 80.16,41.15 80.47,40.84 IC6.9
  Bottom 0.203: v48.46,57.3 48.46,54.86 v49.99,53.34 | v52.12,53.65 53.03,53.65 59.74,46.94 60.35,46.94 v60.96,46.33 | v71.63,53.03 71.63,47.24 76.81,42.06 v80.16,42.06
D12  (via drill 0.3)
  Top 0.203: v50.9,47.55 50.29,47.55 48.77,46.02 48.77,44.5 IC4.13 | v52.43,49.07 52.43,50.6 57,55.17 v57,56.69
  Bottom 0.203: v52.43,49.07 v50.9,47.55 | v57,56.69 57,64.62 56.39,65.23 LCD.16
D13
  Top 0.203: IC4.14 49.38,44.2 49.38,43.28 47.85,41.76 47.24,41.76 46.63,41.15 46.63,38.71 46.33,38.41 43.28,38.41 23.16,58.52 23.16,65.23 LCD.3
D14  (via drill 0.3)
  Top 0.203: RQ.1 67.97,56.08 66.14,56.08 Q1.1 65.84,55.78 v63.7,53.65 | v50.29,46.63 50.29,44.5 IC4.15 | v53.95,53.65 v50.29,49.99
  Bottom 0.203: v50.29,49.99 v50.29,46.63 | v63.7,53.65 v53.95,53.65
D15
  Top 0.203: RD-.1 15.24,36.88 29.57,36.88 33.53,40.84 40.23,40.84 43.28,37.8 48.16,37.8 49.38,39.01 49.38,41.45 51.21,43.28 IC4.16
D18  (via drill 0.3)
  Top 0.203: v55.17,40.54 55.17,44.2 IC4.21 | v49.99,38.1 v52.73,38.1 | v31.7,58.52 31.7,64.01 30.48,65.23 LCD.6
  Bottom 0.203: v52.73,38.1 v55.17,40.54 | v49.99,38.1 47.24,38.1 39.62,45.72 39.62,47.55 35.36,51.82 35.36,54.86 v31.7,58.52
D19  (via drill 0.3)
  Top 0.203: v56.08,42.37 56.08,44.2 IC4.22 | v54.56,35.36 v56.39,37.19 | v25.91,58.52 25.91,65.23 LCD.4
  Bottom 0.203: v56.08,42.37 56.08,41.76 56.39,41.45 v56.39,37.19 | v54.56,35.36 49.38,35.36 39.32,45.41 36.88,45.41 25.91,56.39 v25.91,58.52
D20  (via drill 0.3)
  Top 0.203: v55.78,41.15 57.61,42.98 57.61,46.02 IC4.23 | v34.14,57.91 34.14,60.66 36.88,63.4 v41.45,63.4
  Bottom 0.203: v55.78,41.15 45.41,41.15 43.89,42.67 43.89,48.16 v34.14,57.91 | v41.45,63.4 43.28,65.23 LCD.11
D21  (via drill 0.3)
  Top 0.203: 56.69,46.33 57,46.63 57.61,46.63 IC4.24 | v56.69,42.98 56.69,46.33 | v59.44,40.23 60.35,39.32 60.35,38.71 IC5.14 | v47.55,57.3 v45.72,59.13 | 56.69,46.33 v56.08,46.33
  Bottom 0.203: v59.44,40.23 v56.69,42.98 | v45.72,59.13 45.72,65.23 LCD.12 | v47.55,57.3 47.55,54.86 v56.08,46.33
D22  (via drill 0.3)
  Top 0.203: v59.74,46.33 58.52,47.55 57.91,47.55 IC4.25 | v63.4,40.23 63.4,39.01 63.7,38.71 IC5.11 64.01,38.41 64.01,37.8 64.92,36.88 v64.92,35.36 | v52.43,69.8 53.65,69.8 60.05,63.4 v60.05,52.73
  Bottom 0.203: v59.74,46.33 59.74,43.89 61.57,42.06 | v63.4,40.23 61.57,42.06 | v52.43,69.8 48.77,66.14 48.77,65.53 LCD.13 | v60.05,52.73 60.05,48.16 61.57,46.63 61.57,42.06 | v64.92,35.36 92.35,7.92 92.96,7.92 EXTOUT.4
D23  (via drill 0.3)
  Top 0.203: v56.08,48.46 57.61,48.46 IC4.26 | v50.6,61.27 50.6,64.92 50.9,65.23 LCD.14
  Bottom 0.203: v56.08,48.46 50.6,53.95 v50.6,61.27
GND  (via drill 0.3)
  Top 0.203: C4.2 62.18,49.07 62.18,50.9 C5.2 62.18,51.21 62.18,53.95 66.14,57.91 Q1.2 66.14,58.22 67.97,58.22 RQ.2 68.28,58.22 68.58,58.52 68.58,63.4 MICROSD.GND3 68.58,63.7 67.97,64.31 67.97,67.67 | 67.97,67.67 67.97,69.19 | 67.97,69.19 67.97,72.85 MICROSD.P$1 | 67.97,67.67 v67.67,67.67 | T7.1 74.68,23.16 74.68,25.91 S0.2 74.68,26.21 74.68,31.7 S0.1 | 74.68,37.49 71.93,37.49 CAP.2 71.93,37.8 71.93,40.54 IC6.2 71.93,40.84 71.93,42.06 77.42,47.55 | 74.68,37.49 77.72,37.49 C7.1 | 74.68,37.49 74.68,32 S0.1 | IC5.8 66.45,32.31 67.97,30.79 67.97,30.48 68.28,30.18 72.85,30.18 74.37,31.7 S0.1 | 78.33,50.29 79.25,50.29 IC6.21 | CX3.2 76.5,59.13 78.03,59.13 CX2.2 | 78.64,60.96 78.64,59.44 78.33,59.13 CX2.2 | 78.64,60.96 78.64,62.79 MICROSD.6 | 78.33,50.29 78.33,58.83 CX2.2 | 78.33,50.29 IC6.22 78.33,49.99 78.33,48.46 77.42,47.55 | 83.52,69.19 83.52,72.85 MICROSD.P$2 | 83.52,69.19 83.52,63.7 MICROSD.GND1 83.52,63.4 83.52,60.96 | 83.52,60.96 83.52,50.29 IC6.18 | 83.52,60.96 78.64,60.96 | 83.52,69.19 67.97,69.19 | 87.78,8.84 88.7,7.92 TVSR.A | 87.78,8.84 85.34,11.28 85.34,12.8 T8.1 85.34,13.11 86.87,13.11 89,15.24 90.83,15.24 RJ45.SHIELD1 | 87.78,8.84 87.78,3.35 RAIN.2 | EXTOUT.5 95.71,10.36 95.71,12.8 EXTOUT.7 | RJ45.G- 99.06,19.51 99.06,27.43 RJ45.Y- | RJ45.GND 85.34,28.04 87.48,28.04 90.83,31.39 RJ45.SHIELD0 91.14,31.7 91.14,42.67 | 91.14,42.67 95.4,42.67 98.75,46.02 B3.2 | 91.14,42.67 90.22,42.67 RBS.1 89.92,42.37 84.43,42.37 83.52,41.45 | 91.14,42.67 91.14,48.46 | 91.14,48.46 91.14,53.95 C8.1 | 83.52,41.45 83.52,40.84 IC6.11 83.52,41.45 | 91.14,48.46 94.49,51.82 | 94.49,51.82 98.75,56.08 B2.2
  Top 0.203: 94.49,51.82 94.49,61.27 98.75,65.53 98.75,66.14 B1.2 | 83.52,41.45 77.42,47.55 | IC4.39 52.12,56.08 52.12,57.91 C6.2 51.82,58.22 49.99,58.22 46.94,61.27 | 46.94,61.27 46.63,61.57 42.06,61.57 ISP.6 41.76,61.57 40.84,61.57 39.62,60.35 36.27,60.35 34.75,58.83 34.75,57.3 32.61,55.17 | CX1.2 42.98,48.46 42.98,49.99 CX0.2 | IC4.6 46.02,49.99 43.28,49.99 CX0.2 | LCD.5 28.35,65.23 28.35,59.44 31.7,56.08 BAT.P$1 | 32.61,55.17 32,55.78 BAT.P$1 | 32.61,55.17 37.49,50.29 42.98,50.29 CX0.2 | 32.61,55.17 BAT.P$1 | 10.67,57.91 11.89,56.69 11.89,56.08 IC3.4 | 10.67,57.91 8.23,60.35 6.1,60.35 C9.2 | 10.67,57.91 15.24,62.48 | 15.24,62.48 17.98,65.23 LCD.1 | 15.24,62.48 23.47,54.25 23.47,42.67 IC1.6 23.47,42.37 11.89,42.37 6.1,36.58 6.1,35.05 7.32,33.83 USB.GND 7.62,33.53 7.62,25.91 | T6.1 61.87,13.11 60.35,14.63 56.39,14.63 56.08,14.33 56.08,11.89 54.25,10.06 51.51,10.06 51.21,10.36 51.21,10.67 49.07,12.8 T4.1 48.77,12.8 43.89,7.92 43.89,2.13 43.59,1.83 5.79,1.83 4.57,3.05 C1.- 4.27,3.35 4.27,5.18 1.83,7.62 1.83,16.76 3.05,17.98 PWR.1 3.35,18.29 3.35,25.91 | 26.21,29.87 26.21,32.92 26.82,33.53 IC1.5 27.13,33.83 44.5,33.83 47.85,37.19 48.16,37.19 48.46,37.49 | 26.21,29.87 26.21,29.57 D1.A 26.21,29.87 | 26.21,29.87 23.77,32.31 23.77,33.53 IC1.3 | 51.21,41.15 50.29,40.23 IC2.1 | 51.21,41.15 52.73,42.67 52.73,44.2 IC4.18 53.03,44.5 53.03,47.55 55.47,49.99 57.61,49.99 IC4.28 | 51.82,40.84 51.51,41.15 51.21,41.15 | 51.82,40.84 53.95,38.71 C10.2 | 51.82,40.84 48.46,37.49 | 49.07,25.91 49.07,28.35 49.68,28.96 C3.- 49.99,29.26 51.51,30.79 51.51,34.44 48.46,37.49 | 49.07,25.91 49.07,23.47
  Top 0.203: 49.07,23.47 49.07,23.16 T3.1 49.07,23.47 | 49.07,23.47 54.25,23.47 56.08,21.64 60.35,21.64 61.57,22.86 T5.1 | 30.48,11.58 28.96,11.58 25.91,14.63 | 30.48,11.58 35.05,11.58 36.27,12.8 T2.1 | 25.91,14.63 21.64,14.63 21.03,15.24 D2.A 20.73,15.54 19.2,15.54 9.75,24.99 9.75,25.6 TVS0.A 9.45,25.91 7.62,25.91 | 30.48,11.58 30.48,17.68 35.66,22.86 T1.1 35.97,23.16 38.71,25.91 49.07,25.91 | 7.62,25.91 3.35,25.91 | 3.35,25.91 3.05,25.91 MOV0.2 3.35,25.91 | 25.91,14.63 25.91,18.29 23.47,20.73 23.47,22.86 C2.- | 46.94,61.27 v47.24,61.57
  Bottom 0.203: 53.34,71.02 64.62,71.02 67.67,67.97 v67.67,67.67 | 96.01,15.54 96.01,16.46 98.75,19.2 RJ45.G- | 96.01,15.54 96.01,13.11 EXTOUT.7 | 96.01,15.54 91.14,15.54 RJ45.SHIELD1 | RJ45.Y- 98.75,27.74 95.1,31.39 91.14,31.39 RJ45.SHIELD0 | RF.3 36.58,73.76 36.58,71.93 36.88,71.63 36.88,70.71 33.22,67.06 29.87,67.06 28.35,65.53 LCD.5 28.04,65.53 27.43,65.53 25.91,67.06 17.98,67.06 | 17.98,67.06 17.98,71.02 P0.14 | 17.98,67.06 17.98,65.53 LCD.1 | 53.34,71.02 53.34,69.8 49.68,66.14 49.68,64.01 v47.24,61.57 | 53.34,71.02 JP2.1
  pour Top (isolate 0.61): 0,78.74 101.6,78.74 101.6,0 0,0
  pour Bottom (isolate 0.61): 0,78.74 101.6,78.74 101.6,0 0,0
INT0  (via drill 0.3)
  Top 0.203: v17.37,39.01 15.24,39.01 RD+.1 | v43.89,39.93 43.89,43.89 46.02,46.02 IC4.11
  Bottom 0.203: v17.37,39.01 42.98,39.01 v43.89,39.93
INT1  (via drill 0.3)
  Top 0.203: v58.83,4.57 61.57,1.83 68.28,1.83 69.19,2.74 75.29,2.74 RC.1 | v44.5,39.32 44.5,42.06 46.63,44.2 47.85,44.2 IC4.12
  Bottom 0.203: v58.83,4.57 58.83,25.3 44.81,39.32 v44.5,39.32
INT2  (via drill 0.3)
  Top 0.203: v46.33,60.96 49.38,57.91 49.38,56.08 IC4.42 | v46.33,62.79 44.5,64.62 44.5,69.8 P0.4
  Bottom 0.203: v46.33,62.79 v46.33,60.96
LEDA
  Top 0.203: REA.2 96.01,32.92 96.01,30.18 97.84,28.35 97.84,17.98 98.75,17.07 RJ45.G+
LEDB
  Top 0.203: REB.2 96.01,34.75 96.62,34.14 96.93,34.14 98.75,32.31 98.75,30.18 RJ45.Y+
MISO  (via drill 0.3)
  Top 0.203: 43.28,59.74 43.28,58.83 47.55,54.56 47.55,53.65 47.24,53.34 46.33,53.34 IC4.2 | 43.28,59.74 42.67,60.35 41.45,60.35 40.84,59.74 40.84,58.83 39.93,57.91 38.41,57.91 37.19,59.13 ISP.1 | v79.55,61.57 79.55,62.79 MICROSD.7 | v76.81,42.98 76.81,40.84 IC6.6 | 50.9,67.67 50.9,71.02 P0.1 | 50.9,67.67 52.43,66.14 52.43,64.31 54.56,62.18 v58.83,62.18 | v46.33,59.74 43.28,59.74 | v49.99,63.4 49.99,66.75 50.9,67.67
  Bottom 0.203: v79.55,61.57 76.5,61.57 75.89,62.18 75.29,62.18 74.98,61.87 | 74.98,61.87 72.85,59.74 72.85,46.94 v76.81,42.98 | v58.83,62.18 61.57,62.18 61.87,61.87 74.98,61.87 | v49.99,63.4 v46.33,59.74
MOSI  (via drill 0.3)
  Top 0.203: v75.59,61.57 75.59,62.79 MICROSD.3 | v78.03,43.28 78.03,40.84 IC6.7 | v43.28,56.69 46.02,53.95 IC4.1 | v60.05,64.31 54.56,69.8 54.56,71.63 53.65,72.54 49.68,72.54 P0.2
  Bottom 0.203: 75.59,60.96 75.59,56.69 74.07,55.17 74.07,47.24 v78.03,43.28 | 75.59,60.96 v75.59,61.57 | v43.28,56.69 43.28,59.74 42.67,60.35 | 42.67,60.35 42.37,60.66 40.54,60.66 39.62,61.57 ISP.4 | 42.67,60.35 44.5,62.18 44.5,66.14 48.16,69.8 48.16,71.02 P0.2 | 75.59,60.96 79.86,60.96 80.16,61.27 80.16,61.87 78.64,63.4 70.71,63.4 69.8,62.48 61.87,62.48 v60.05,64.31
N$1  (via drill 0.3)
  Top 0.406: v12.8,42.98 4.57,51.21 2.13,51.21 J2.3
  Bottom 0.406: v12.8,42.98 12.8,30.48 15.85,27.43 F0.1A
N$2  (via drill 0.3)
  Top 0.406: v25.3,31.7 25.3,33.53 IC1.4 | 27.43,22.25 26.82,22.86 C2.+ | 27.43,22.25 28.35,21.34 28.35,16.76 F1.1 | 27.43,22.25 33.53,28.35 36.27,28.35 L1.2
  Bottom 0.406: v25.3,31.7 25.3,24.38 26.52,23.16 C2.+
N$3
  Top 0.203: RC.2 77.72,3.05 82.3,3.05 RAIN.1 82.6,3.05 83.82,1.83 88.09,1.83 90.53,4.27 90.53,9.14 89,10.67 TVSR.C
N$4
  Top 0.203: R6.2 63.7,28.96 63.7,30.79 62.79,31.7 62.79,32.31 IC5.5
N$5
  Top 0.203: R7.2 65.84,28.96 65.84,29.87 64.01,31.7 64.01,32.31 IC5.6
N$6
  Bottom 0.406: J2.2 2.13,54.25 2.13,52.73 7.01,47.85 7.01,37.49 1.83,32.31 1.83,15.54 3.05,14.33 PWR.2
N$7
  Top 0.203: R8.2 67.97,28.96 65.23,31.7 65.23,32.31 IC5.7
N$8
  Top 0.203: IC3.1 8.23,55.78 8.23,53.03 X2.2
N$9
  Top 0.406: D1.C 21.95,29.57 21.95,33.53 IC1.2 21.95,33.83 21.95,34.75 23.47,36.27 34.44,36.27 36.27,38.1 L1.1
N$10
  Top 0.203: R5.2 61.87,28.96 61.87,32 61.57,32.31 IC5.4
N$11
  Top 0.203: R4.2 60.05,28.96 60.05,32.31 IC5.3
N$12
  Top 0.203: R3.2 58.22,28.96 58.22,32 58.52,32.31 IC5.2
N$13
  Top 0.203: R2.2 56.08,28.96 56.08,31.09 57.3,32.31 IC5.1
N$14
  Top 0.203: R1.2 54.25,28.96 54.25,33.22 58.52,37.49 58.52,38.41 IC5.15
N$15  (via drill 0.3)
  Top 0.203: X0.2 38.71,51.51 39.01,51.82 42.98,51.82 CX0.1 43.28,51.82 43.89,51.21 v44.5,51.21 | v47.55,49.38 46.33,49.38 IC4.7
  Bottom 0.203: v47.55,49.38 46.33,49.38 v44.5,51.21
N$16  (via drill 0.3)
  Top 0.406: 34.14,17.07 33.53,17.07 T1.4 34.14,17.07 | 34.14,17.07 39.93,17.07 TVS1.A | 34.14,17.07 v32.31,15.24
  Bottom 0.406: v32.31,15.24 32.31,3.35 S12.1
N$17
  Top 0.406: 37.49,7.01 34.14,7.01 T2.4 | 37.49,7.01 39.93,7.01 TVS2.A | 37.49,7.01 37.49,3.35 S12.2
N$18
  Top 0.406: TVS3.A 52.73,17.07 46.63,17.07 T3.4 46.33,16.76 45.41,16.76 42.67,14.02 42.67,3.35 S34.1
N$19
  Top 0.203: X0.1 38.71,46.63 42.98,46.63 CX1.1 43.28,46.63 44.81,48.16 46.02,48.16 IC4.8
N$20
  Top 0.406: 47.55,7.01 46.63,7.01 T4.4 47.55,7.01 | 47.55,7.01 52.73,7.01 TVS4.A | 47.55,7.01 47.55,3.35 S34.2
N$21  (via drill 0.3)
  Top 0.203: v52.12,24.69 53.95,26.52 R1.1 | v32.61,24.69 31.09,23.16 T1.3
  Bottom 0.203: v32.61,24.69 v52.12,24.69
N$22  (via drill 0.3)
  Top 0.406: TVS5.A 65.84,17.07 59.74,17.07 T5.4 59.44,16.76 v57.91,15.24
  Bottom 0.406: v57.91,15.24 52.73,10.06 52.73,3.35 S56.1
N$23
  Top 0.406: TVS6.A 65.84,7.01 59.74,7.01 T6.4 59.44,6.71 57.91,5.18 57.91,3.35 S56.2
N$24  (via drill 0.3)
  Top 0.406: TVS7.A 78.94,27.13 78.94,24.99 75.89,21.95 75.89,20.42 72.54,17.07 T7.4 72.24,16.76 v70.1,16.76
  Bottom 0.406: v70.1,16.76 62.79,9.45 62.79,3.35 S78.1
N$25
  Top 0.406: 79.25,13.72 79.25,10.67 82.91,7.01 T8.4 | 79.25,13.72 79.25,17.07 TVS8.A | 79.25,13.72 73.15,13.72 67.97,8.53 67.97,3.35 S78.2
N$26  (via drill 0.3)
  Top 0.203: v53.34,24.08 55.78,26.52 R2.1 | v33.53,14.94 T2.3
  Bottom 0.203: v53.34,24.08 42.67,24.08 v33.53,14.94
N$27  (via drill 0.3)
  Top 0.203: v56.69,25.3 57.91,26.52 R3.1 | v46.33,25.3 44.2,23.16 T3.3
  Bottom 0.203: v46.33,25.3 v56.69,25.3
N$28  (via drill 0.3)
  Top 0.203: v58.22,24.99 59.74,26.52 R4.1 | v44.5,11.28 44.5,12.5 44.2,12.8 T4.3
  Bottom 0.203: v44.5,11.28 v58.22,24.99
N$29
  Top 0.203: R5.1 61.87,26.52 60.05,24.69 58.83,24.69 57.3,23.16 T5.3
N$30
  Top 0.203: IC3.2 9.45,55.78 9.45,54.25 10.67,53.03 X2.1
N$31
  Top 0.203: R6.1 64.01,26.52 67.06,23.47 67.36,23.47 68.28,22.55 68.28,10.97 67.36,10.06 60.05,10.06 57.3,12.8 T6.3
N$32  (via drill 0.3)
  Top 0.203: v63.7,59.44 63.7,57.3 Q1.3 | v62.79,60.35 62.18,60.96 62.18,62.79 DF.A 61.87,63.09 61.87,67.06 59.74,69.19 RELAY.9
  Bottom 0.203: v62.79,60.35 v63.7,59.44
N$33
  Top 0.203: R7.1 66.14,26.52 69.49,23.16 70.1,23.16 T7.3
N$34  (via drill 0.3)
  Top 0.203: v91.75,37.19 91.75,35.36 93.88,33.22 REA.1 | v74.98,47.24 74.37,47.24 71.63,49.99 IC6.27
  Bottom 0.203: v91.75,37.19 81.69,47.24 v74.98,47.24
N$35
  Top 0.203: R8.1 68.28,26.52 69.19,26.52 71.32,24.38 71.32,19.2 69.49,17.37 69.49,16.46 70.71,15.24 74.37,15.24 77.42,18.29 77.42,18.59 77.72,18.9 80.47,18.9 80.77,18.59 80.77,13.11 T8.3
N$36
  Top 0.203: IC3.3 10.67,55.78 10.67,55.17 11.28,54.56 14.63,54.56 15.85,55.78 BAT.P$2
N$37  (via drill 0.3)
  Top 0.203: v91.75,38.1 93.88,35.97 93.88,35.05 REB.1 | v74.68,48.16 72.85,49.99 IC6.26
  Bottom 0.203: v91.75,38.1 81.69,48.16 v74.68,48.16
N$38
  Top 0.203: RD+.2 12.8,38.71 10.06,38.71 7.62,36.27 USB.D+
N$39
  Top 0.203: CAP.1 70.41,37.8 70.41,40.54 IC6.1
N$41
  Top 0.203: CX3.1 74.68,58.83 74.68,55.17 74.98,54.86 X1.2 75.29,54.56 75.59,54.25 75.59,50.29 IC6.24
N$42  (via drill 0.3)
  Top 0.203: CX2.1 79.86,58.83 79.86,54.86 X1.1 | v76.81,48.77 76.81,49.99 IC6.23
  Bottom 0.203: v76.81,48.77 76.81,51.51 79.86,54.56 X1.1
N$45
  Top 0.203: 13.11,35.97 13.11,36.88 RD-.2 | 13.11,35.97 13.11,35.05 RUSB.1 | 13.11,35.97 9.75,35.97 USB.D-
N$54
  Top 0.203: RR+.2 82.3,35.66 80.77,35.66 RR-.1 80.47,35.66 78.03,35.66 C7.2
N$59
  Top 0.203: RBS.2 89.92,40.54 87.17,40.54 IC6.14
NC
  Top 0.406: RELAY.1 64.31,67.06 57.61,73.76 57.61,75.89 57,76.5 53.34,76.5 50.29,73.46 45.72,73.46 44.5,74.68 JP0.1
NO
  Top 0.406: JP1.1 55.17,74.37 55.17,71.32 59.44,67.06 RELAY.10
QH*  (via drill 0.3)
  Top 0.203: v68.89,35.97 66.45,38.41 IC5.9 | v89.61,14.02 90.22,14.02 92.05,12.19 92.05,6.4 92.96,5.49 EXTOUT.2
  Bottom 0.203: v68.89,35.97 68.89,34.75 v89.61,14.02
RD+
  Top 0.203: 83.82,38.1 85.65,39.93 85.65,40.54 IC6.13 | 83.82,38.1 83.21,37.49 82.6,37.49 RR+.1 | 83.82,38.1 83.82,24.99 84.73,24.08 85.65,24.08 87.48,22.25 87.48,21.64 RJ45.RD+
RD-  (via drill 0.3)
  Top 0.203: 83.52,39.32 83.82,39.32 84.43,39.93 84.43,40.54 IC6.12 | 83.52,39.32 82.3,39.32 81.38,38.41 81.38,38.1 80.77,37.49 RR-.2 | 83.52,39.32 v83.52,38.71
  Bottom 0.203: v83.52,38.71 83.52,27.74 85.04,26.21 85.04,25.6 RJ45.RD-
RECAC  (via drill 0.3)
  Top 0.406: D0.C 9.45,13.11 9.45,11.89 4.57,7.01 C1.+ | v19.81,29.57 19.81,33.53 IC1.1
  Bottom 0.406: v19.81,29.57 19.81,22.25 4.57,7.01 C1.+
RESET  (via drill 0.3)
  Top 0.203: 42.06,54.86 45.11,51.82 46.02,51.82 IC4.4 | 42.06,54.86 42.06,59.13 ISP.5 | v71.63,29.57 71.63,26.21 S0.4 | v70.41,30.79 71.32,31.7 S0.3 71.63,32 71.93,32.31 71.93,34.44 RR.1 72.24,34.75 v73.15,35.66 | v75.89,38.41 80.16,38.41 81.99,40.23 81.99,40.54 IC6.10 | 42.06,54.86 36.88,54.86 v36.27,54.25
  Bottom 0.203: v71.63,29.57 v70.41,30.79 65.23,35.97 53.95,35.97 51.21,38.71 47.24,38.71 42.67,43.28 42.67,45.11 36.27,51.51 v36.27,54.25 | v73.15,35.66 v75.89,38.41
RXD  (via drill 0.3)
  Top 0.203: v27.13,61.57 26.52,60.96 26.52,55.78 36.88,45.41 43.89,45.41 44.2,45.72 44.2,46.33 45.41,47.55 46.02,47.55 IC4.9
  Bottom 0.203: v27.13,61.57 34.14,61.57 37.19,64.62 37.19,70.1 38.1,71.02 P0.6
SCK  (via drill 0.3)
  Top 0.203: v42.67,56.08 42.67,55.17 45.41,52.43 46.02,52.43 IC4.3 | v77.42,64.31 77.42,63.09 MICROSD.5 77.42,62.79 77.42,61.87 75.89,60.35 v74.98,60.35 | v79.25,42.67 79.25,40.84 IC6.8
  Bottom 0.203: v42.67,56.08 39.62,59.13 ISP.3 39.32,59.44 39.32,60.35 38.41,61.27 38.41,63.09 39.62,64.31 39.62,66.14 43.28,69.8 44.5,69.8 45.72,71.02 P0.3 45.72,71.32 46.94,72.54 63.7,72.54 71.93,64.31 v77.42,64.31 | v79.25,42.67 77.72,42.67 77.42,42.98 77.42,43.28 73.46,47.24 73.46,58.83 v74.98,60.35
SCL  (via drill 0.3)
  Top 0.203: RCL.1 10.06,64.31 10.06,62.48 10.36,62.18 IC3.6 10.67,61.87 10.67,61.27 v11.89,60.05 | v53.65,45.72 53.65,44.5 IC4.19 | v44.5,42.98 v46.63,45.11 | v27.74,59.13 27.74,63.7 27.13,64.31 27.13,70.41 27.74,71.02 P0.10
  Bottom 0.203: v53.65,45.72 53.03,45.72 52.43,45.11 v46.63,45.11 | v44.5,42.98 44.5,48.46 33.83,59.13 v27.74,59.13 25.3,59.13 24.38,60.05 v11.89,60.05
SDA  (via drill 0.3)
  Top 0.203: v52.73,41.76 54.25,43.28 54.25,44.2 IC4.20 | v13.11,61.27 12.19,62.18 IC3.5 11.89,62.18 11.89,64.31 RDA.1 | v24.08,60.66 24.08,65.84 25.3,67.06 25.3,71.02 P0.11
  Bottom 0.203: v52.73,41.76 45.41,41.76 45.11,42.06 45.11,48.46 33.83,59.74 25.3,59.74 24.08,60.96 | 24.08,60.96 23.77,61.27 v13.11,61.27 | 24.08,60.96 v24.08,60.66
TCT  (via drill 0.3)
  Top 0.203: RT+.2 85.04,56.08 86.87,56.08 RT-.1 87.17,56.08 87.17,58.22 89.92,60.96 92.05,60.96 92.35,60.66 92.35,59.44 91.14,58.22 L2.1 91.14,57.91 91.14,56.08 C8.2 90.83,56.08 89.92,55.17 89.92,51.21 84.12,45.41 v82.3,45.41 | v82.3,25.91 85.04,23.16 RJ45.P4
  Bottom 0.203: v82.3,45.41 v82.3,25.91
TD+  (via drill 0.3)
  Top 0.203: RT+.1 84.73,53.95 84.73,50.29 IC6.17 84.73,49.99 v84.73,48.16
  Bottom 0.203: v84.73,48.16 84.73,46.94 92.96,38.71 92.96,36.88 92.05,35.97 90.53,35.97 88.7,37.8 86.26,37.8 84.12,35.66 84.12,30.48 86.56,28.04 86.56,20.12 87.48,19.2 RJ45.TD+
TD-  (via drill 0.3)
  Top 0.203: RT-.2 86.87,53.95 v86.87,51.82 85.95,50.9 85.95,50.29 IC6.16
  Bottom 0.203: v86.87,51.82 84.12,49.07 84.12,46.94 92.35,38.71 92.35,36.88 92.05,36.58 91.44,36.58 88.7,39.32 83.21,39.32 82.91,39.01 82.91,22.55 85.04,20.42 RJ45.TD-
TXD  (via drill 0.3)
  Top 0.203: v43.28,44.2 44.81,45.72 44.81,46.33 45.11,46.63 46.02,46.63 IC4.10 | v32.61,58.52 32.61,63.7 32,64.31 32,67.67 34.14,69.8 39.32,69.8 P0.5
  Bottom 0.203: v43.28,44.2 43.28,48.16 34.14,57.3 33.83,57.3 v32.61,58.52
VCC  (via drill 0.3)
  Top 0.203: 53.34,60.05 57.3,60.05 RPR.2 | 53.34,60.05 52.12,60.05 C6.1 51.82,60.05 49.68,60.05 47.55,62.18 44.5,62.18 42.37,64.31 42.37,65.84 40.23,67.97 v33.22,67.97 | 51.82,47.55 51.82,44.5 IC4.17 | 49.38,49.99 48.77,50.6 46.33,50.6 IC4.5 | 49.38,49.99 51.82,47.55 | 49.38,49.99 52.73,53.34 52.73,55.78 IC4.38 53.03,56.08 53.03,57 53.34,57.3 53.34,60.05 | L2.2 90.83,59.74 88.09,57 88.09,51.21 87.17,50.29 IC6.15 86.87,49.99 86.87,49.38 85.04,47.55 84.43,47.55 82.3,49.68 82.3,49.99 IC6.19 81.99,50.29 80.77,50.29 IC6.20 80.47,49.99 v80.47,48.77 | 57,38.71 57.3,38.71 IC5.16 | 57,38.71 56.08,38.71 C10.1 | 60.35,41.45 59.74,41.45 57,38.71 | 60.35,41.45 60.96,41.45 ROE.2 | 60.35,41.45 60.35,45.72 | 60.35,45.72 60.35,48.77 C4.1 60.05,49.07 57.91,49.07 IC4.27 57.61,49.07 55.47,49.07 v53.95,47.55 | 72.24,53.03 72.24,52.43 70.71,50.9 70.71,50.29 IC6.28 70.41,49.99 66.14,45.72 64.92,45.72 | 72.24,53.03 72.24,59.74 | 72.24,59.74 73.46,60.96 75.89,60.96 76.5,61.57 76.5,62.79 MICROSD.4 | 72.24,59.74 RSD.2 | 72.24,53.03 74.37,50.9 74.37,50.29 IC6.25 74.37,49.99 76.2,48.16 77.11,48.16 v77.72,48.77 | 64.92,45.72 60.35,45.72 | 43.89,30.18 44.81,29.26 C3.+ | 43.89,30.18 42.98,31.09 33.83,31.09 30.48,27.74 20.73,27.74 15.24,33.22 15.24,34.75 RUSB.2 | 43.89,30.18 44.2,30.18 47.85,33.83 IC2.4 48.16,34.14 v50.9,34.14 | 68.58,34.75 68.28,34.75 65.23,37.8 65.23,38.41 IC5.10 64.92,38.71 64.92,45.72 | 68.58,34.75 69.8,34.75 RR.2 | 68.58,34.75 v68.58,30.79 | v52.43,47.55 51.82,47.55
  Bottom 0.203: v33.22,67.97 26.82,67.97 23.77,71.02 22.86,71.02 P0.12 | v77.72,48.77 v80.47,48.77 | EXTOUT.1 95.71,5.49 94.49,5.49 93.57,6.4 92.96,6.4 v68.58,30.79 65.23,34.14 v50.9,34.14 | v53.95,47.55 v52.43,47.55
VIN  (via drill 0.3)
  Top 0.406: DF.C 66.14,63.09 66.14,65.84 66.45,66.14 66.45,67.67 64.62,69.49 RELAY.2 | v45.72,42.37 45.72,40.23 IC2.3 | F1.2 24.38,16.76 22.55,18.59 21.03,18.59 D2.C 20.73,18.9 20.73,26.52 13.72,33.53 9.75,33.53 USB.VBUS | IC3.8 7.92,62.18 6.1,62.18 C9.1 5.79,62.48 9.75,66.45 RCL.2 10.06,66.45 11.89,66.45 RDA.2 12.19,66.75 17.07,66.75 20.42,70.1 | 20.42,70.1 20.42,71.02 P0.13 | 20.42,70.1 20.42,65.53 LCD.2
  Bottom 0.406: RELAY.2 64.31,69.19 63.4,68.28 56.39,68.28 53.65,65.53 LCD.15 53.34,65.23 41.45,53.34 41.15,53.34 | v45.72,42.37 45.72,48.77 41.15,53.34 | 41.15,53.34 35.66,58.83 35.66,60.35 | 35.66,60.35 36.88,61.57 ISP.2 | RF.2 33.83,74.07 31.7,76.2 25.3,76.2 20.42,71.32 P0.13 | USB.VBUS 9.75,33.83 9.75,34.44 11.89,36.58 11.89,58.83 10.97,59.74 10.97,60.35 14.02,63.4 18.59,63.4 20.42,65.23 LCD.2 20.73,65.23 25.6,60.35 35.66,60.35

### Text on the board
tNames: OpenSprinkler v2.1 | (Rev 11/25/13) | A3 VIN GND | NC | CO | NO | Rayshobby LLC | www.opensprinkler.com | GND VIN VCC SDA SCL A05 A06 A07 RXD TXD INT2 SCK SI SO GND | PWR | EXTOUT | S1-8 | RAIN
BoxDim: Serpac WM-032C Enclosure | All units are in inch | Left | Right | Front | Bottom